# Altium schematic sheet ITCoffeeOne_Lite_V4.02_1.SchDoc: GaggiaBoard_V3
size 270 x 223 mm; Origin: Eagle; Date: 2023-10-17 12:57:02; SheetNumber: 2; GateName_1: G$1; SymbolName_1: LETTER_L; LibraryName: frames; DeviceSetName: LETTER_L; GateName_2: G$2; SymbolName_2: DOCFIELD; Sheet: Sheet:; REV: REV:
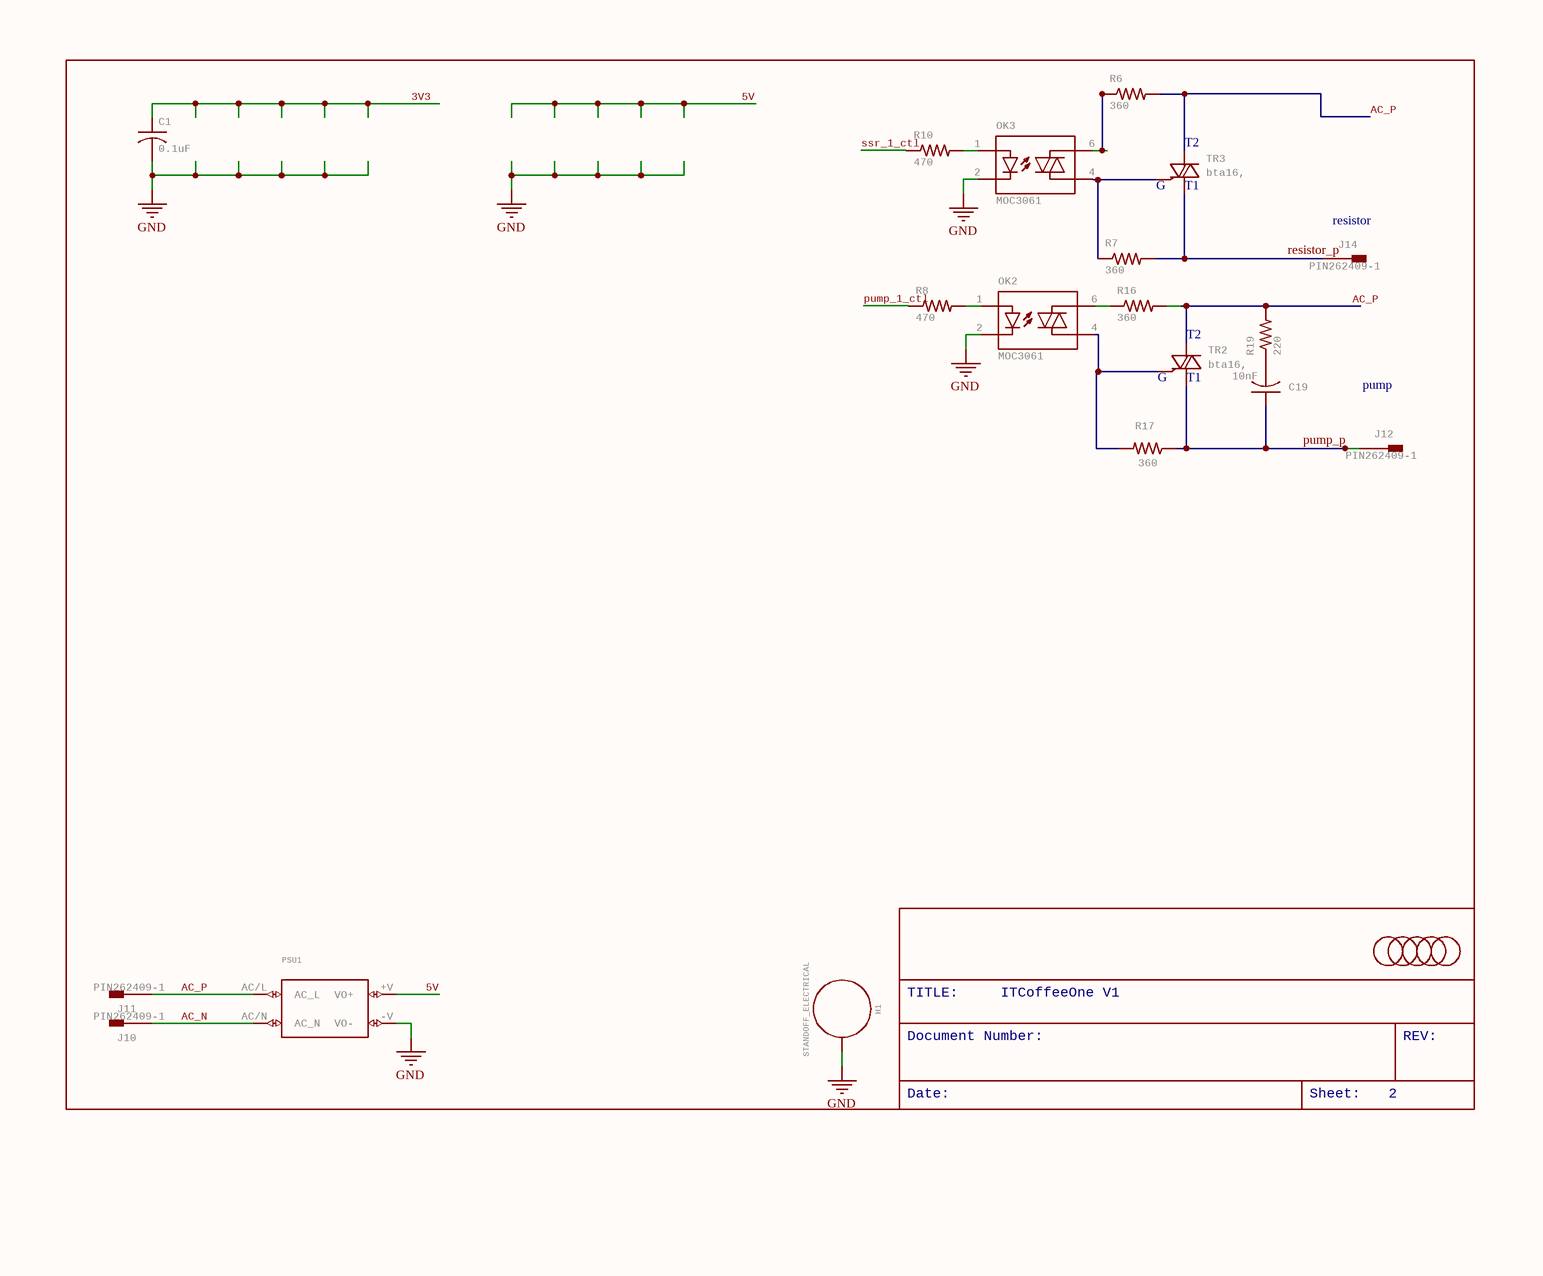
[diagram p0: ITCoffeeOne_Lite_V4.02_1.SchDoc]

## Parts
C1  0.1uF  [C0603]
C19  10nF  [C1206]
H1  STANDOFF_ELECTRICAL  [STANDOFF-ELECTRICAL]
J10  PIN262409-1  [62409-1]
J11  PIN262409-1  [62409-1]
J12  PIN262409-1  [62409-1]
J14  PIN262409-1  [62409-1]
MARK3  FIDUCIAL  [FIDUCIAL_1MM]  (value not drawn)
MARK4  FIDUCIAL  [FIDUCIAL_1MM]  (value not drawn)
MARK6  FIDUCIAL  [FIDUCIAL_1MM]  (value not drawn)
MARK7  FIDUCIAL  [FIDUCIAL_1MM]  (value not drawn)
MARK8  FIDUCIAL  [FIDUCIAL_1MM]  (value not drawn)
OK2  MOC3061  [DIL06O]
OK3  MOC3061  [DIL06O]
PSU1  (no value)  [IRM-10]
R6  360  [R0603]
R7  360  [R0603]
R8  470  [R0603]
R10  470  [R0603]
R16  360  [R0603]
R17  360  [R0603]
R19  220  [R2512]
TR2  bta16,  [TO-220AB]
TR3  bta16,  [TO-220AB]

## Nets
GND: C1.2 H1.P1(P$1) OK2.2(C) OK3.2(C) PSU1.-V(VO-)
3V3: C1.1
5V: PSU1.+V(VO+)
AC_N: J10.A1,A2 PSU1.AC/N(AC_N)
AC_P: J11.A1,A2 PSU1.AC/L(AC_L) R6.2 R16.2 R19.2 TR2.2(A2) TR3.2(A2)
pump_1_ctl: R8.1
pump_p: C19.1 J12.A1,A2 R17.1 TR2.1(A1)
resistor_p: J14.A1,A2 R7.2 TR3.1(A1)
ssr_1_ctl: R10.1
NetC19_2: C19.2 R19.1
NetOK2_1: OK2.1(A) R8.2
NetOK2_4: OK2.4(A1) R17.2 TR2.3(G)
NetOK2_6: OK2.6(A2) R16.1
NetOK3_1: OK3.1(A) R10.2
NetOK3_4: OK3.4(A1) R7.1 TR3.3(G)
NetOK3_6: OK3.6(A2) R6.1

## Notes on the sheet
- (near J14) resistor
- (near J12) pump
- TITLE:
- ITCoffeeOne V1
- Document Number:
- REV:
- Date:
- Sheet:
- 2
- (in symbol BTA) T2; T1

## Library data of the parts
C1 = C-USC0603: CAPACITOR, American symbol; GateName_1: G$1; SymbolName_1: C-US; POPULARITY: 37; DeviceName: C0603; LibraryName: rcl; DeviceSetName: C-US; LCSC: C1591; SPICEPREFIX: C
C19 = C-USC1206: CAPACITOR, American symbol; GateName_1: G$1; SymbolName_1: C-US; POPULARITY: 24; DeviceName: C1206; LibraryName: rcl; DeviceSetName: C-US; LCSC: C107192; SPICEPREFIX: C
H1 = STANDOFF_ELECTRICAL: Stand Off    Drill holes with an electrical connection. For example, use these to ground your board to a chassis. Example SparkFun Products  Screw - Phillips Head (1/4", 4-40, 10 pack) (PRT-10453)  Screw - Phillips Head (1/2", 4-40, 10 pack) (PRT-10452)  Screw - Phillips Head (3/4", 4-40, 10 pack) (PRT-10451)  Screw - Phillips Head (1", 4-40, 10 pack) (PRT-10450); GateName_1: G$1; SymbolName_1: STANDOFF_ELECTRICAL; LibraryName: SparkFun-Hardware; DeviceSetName: STANDOFF_ELECTRICAL
J10-J12 J14 = PIN262409-1: Flachstecker Typ Tyco/Electronics/AMP TAB, FASTON   Printed Circuit Board Tabs Source: http://www.buerklin.com, http://catalog.tycoelectronics.com; GateName_1: -1; SymbolName_1: PIN; DeviceSetName: PIN2; DeviceName: 62409-1; LibraryName: con-faston; LCSC: C86495; MF: MF; MPN: MPN; OC_FARNELL: unknown; OC_NEWARK: unknown
MARK3 MARK4 MARK6-MARK8 = FIDUCIAL: For use by pick and place machines to calibrate the vision/machine, 1mm    By microbuilder.eu; GateName_1: G$1; SymbolName_1: DOT; LibraryName: adafruit; DeviceSetName: FIDUCIAL
OK2 OK3 = MOC3021MDIL06O: zero cross OPTOISOLATORS TRIAC DRIVER OUTPUT; GateName_1: G$1; SymbolName_1: OK-TR; DeviceName: DIL06O; LibraryName: discrete; DeviceSetName: MOC3021M; LCSC: C5242
PSU1 = IRM-10-5: MEAN WELL IRM-10-5 5V 10W Output Switching Power Supply; GateName_1: G$1; SymbolName_1: PSU; LibraryName: discrete; DeviceSetName: IRM-10-5; LCSC: C2857903; SPICEPREFIX: E
R6-R8 R10 R16 R17 = R-US_R0603: RESISTOR, American symbol; GateName_1: G$1; SymbolName_1: R-US; DeviceSetName: R-US_; POPULARITY: 77; DeviceName: R0603; LibraryName: rcl; LCSC: C114669; SPICEPREFIX: R
R19 = R-US_R2512: RESISTOR, American symbol; GateName_1: G$1; SymbolName_1: R-US; DeviceSetName: R-US_; POPULARITY: 0; DeviceName: R2512; LibraryName: rcl; LCSC: C877859; SPICEPREFIX: R
TR2 TR3 = BTA: Triacs 16Amp 600 Volt; GateName_1: G$1; SymbolName_1: TRIAC; DeviceName: TO-220AB; LibraryName: discrete; DeviceSetName: BTA16; LCSC: C71218